# Altium schematic sheet Mother Board LCD.SchDoc
size A4
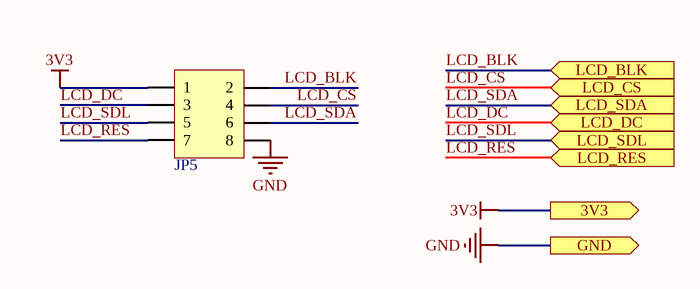
[diagram p0: Mother Board LCD.SchDoc]

## Parts
JP5  Header 4X2  [HEARDER_0.8mm_2x4P_G]  (value not drawn)

## Ports
3V3 (out), GND (out), LCD_BLK (in), LCD_CS (in), LCD_DC (in), LCD_RES (in), LCD_SDA (in), LCD_SDL (in)

## Nets
3V3: JP5.1 ; port 3V3
GND: JP5.8 ; port GND
LCD_BLK: JP5.2 ; port LCD_BLK
LCD_CS: JP5.4 ; port LCD_CS
LCD_DC: JP5.3 ; port LCD_DC
LCD_RES: JP5.7 ; port LCD_RES
LCD_SDA: JP5.6 ; port LCD_SDA
LCD_SDL: JP5.5 ; port LCD_SDL

## Library data of the parts
JP5 = Header 4PX2: 4*2P接插件; 版权归属: 源创客; BOM名称: 4*2P接插件; 学习资源: www.ooocke.com